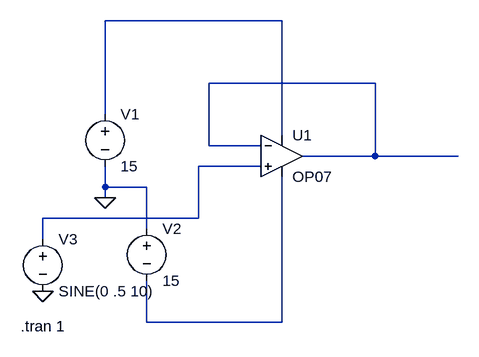
[diagram p0: schematic VoltageBuffer.asc]
VoltageBuffer.asc, the LTspice schematic file:
Version 4
SHEET 1 880 680
WIRE 400 -96 128 -96
WIRE 544 0 288 0
WIRE 128 48 128 -96
WIRE 400 80 400 -96
WIRE 288 96 288 0
WIRE 368 96 288 96
WIRE 544 112 544 0
WIRE 544 112 432 112
WIRE 672 112 544 112
WIRE 368 128 272 128
WIRE 128 160 128 128
WIRE 192 160 128 160
WIRE 128 176 128 160
WIRE 272 208 272 128
WIRE 272 208 32 208
WIRE 192 224 192 160
WIRE 32 240 32 208
WIRE 192 368 192 304
WIRE 400 368 400 144
WIRE 400 368 192 368
FLAG 128 176 0
FLAG 32 320 0
SYMBOL voltage 128 32 R0
WINDOW 123 0 0 Left 0
WINDOW 39 0 0 Left 0
SYMATTR InstName V1
SYMATTR Value 15
SYMBOL voltage 192 208 R0
WINDOW 123 0 0 Left 0
WINDOW 39 0 0 Left 0
SYMATTR InstName V2
SYMATTR Value 15
SYMBOL voltage 32 224 R0
WINDOW 123 0 0 Left 0
WINDOW 39 0 0 Left 0
SYMATTR InstName V3
SYMATTR Value SINE(0 .5 10)
SYMBOL OpAmps\\OP07 400 48 R0
SYMATTR InstName U1
TEXT -2 374 Left 2 !.tran 1

The netlist it stands for:
* VoltageBuffer.asc
V1 N001 0 15
V2 0 N004 15
V3 N003 0 SINE(0 .5 10)
XU1 N003 N002 N001 N004 N002 LT1001  ; OP07, pins In+ In- V+ V- OUT
.tran 1
.lib LTC.lib
.backanno
.end